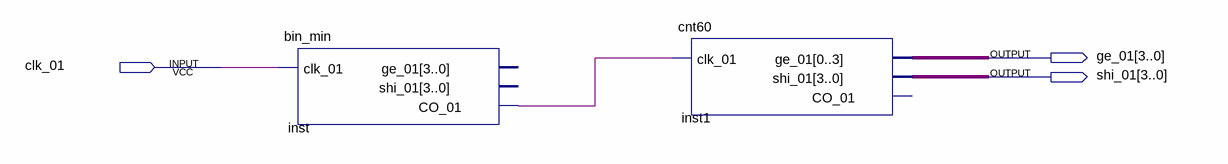
[diagram p0: schematic sheet]
// Quartus schematic bin_sec.bdf as structural Verilog: 2 symbols, 3 pins
module bin_sec (
  input  clk_01,
  output [3:0] ge_01,
  output [3:0] shi_01
);

  wire inst_co_01;

  bin_min inst (.clk_01(clk_01), .CO_01(inst_co_01));  // open: ge_01, shi_01
  cnt60 inst1 (.clk_01(inst_co_01), .ge_01(ge_01), .shi_01(shi_01));  // open: CO_01
endmodule
